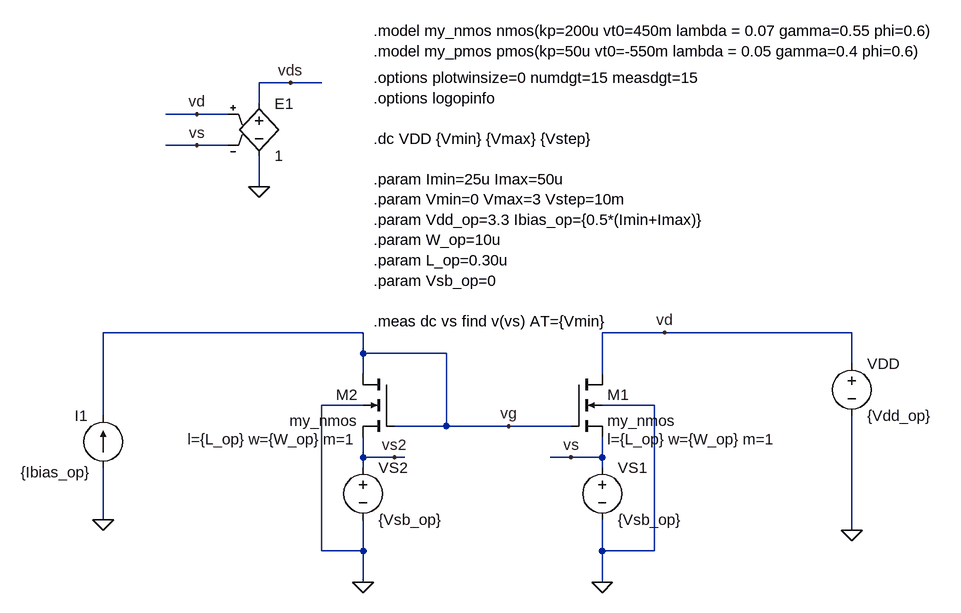
[diagram p0: schematic dc_no_step.asc]
dc_no_step.asc, the LTspice schematic file:
Version 4.1
SHEET 1 2428 7372
WIRE -736 -464 -784 -464
WIRE -688 -464 -736 -464
WIRE -784 -432 -784 -464
WIRE -880 -416 -928 -416
WIRE -832 -416 -880 -416
WIRE -880 -368 -928 -368
WIRE -832 -368 -880 -368
WIRE -784 -304 -784 -352
WIRE -624 -80 -1024 -80
WIRE -160 -80 -256 -80
WIRE 128 -80 -160 -80
WIRE -624 -48 -624 -80
WIRE -496 -48 -624 -48
WIRE 128 -32 128 -80
WIRE -624 -16 -624 -48
WIRE -256 -16 -256 -80
WIRE -624 32 -688 32
WIRE -176 32 -256 32
WIRE -1024 48 -1024 -80
WIRE -496 64 -496 -48
WIRE -496 64 -576 64
WIRE -400 64 -496 64
WIRE -304 64 -400 64
WIRE -624 112 -624 80
WIRE -576 112 -624 112
WIRE -560 112 -576 112
WIRE -304 112 -336 112
WIRE -256 112 -256 80
WIRE -256 112 -304 112
WIRE -624 128 -624 112
WIRE -256 128 -256 112
WIRE -1024 208 -1024 128
WIRE 128 224 128 48
WIRE -688 256 -688 32
WIRE -624 256 -624 208
WIRE -624 256 -688 256
WIRE -256 256 -256 208
WIRE -176 256 -176 32
WIRE -176 256 -256 256
WIRE -624 304 -624 256
WIRE -256 304 -256 256
FLAG -256 304 0
FLAG -624 304 0
FLAG 128 224 0
FLAG -1024 208 0
FLAG -400 64 vg
FLAG -160 -80 vd
FLAG -576 112 vs2
FLAG -304 112 vs
FLAG -784 -304 0
FLAG -736 -464 vds
FLAG -880 -416 vd
FLAG -880 -368 vs
SYMBOL voltage -256 112 R0
SYMATTR InstName VS1
SYMATTR Value {Vsb_op}
SYMBOL nmos4 -304 -16 R0
WINDOW 123 56 100 Left 2
SYMATTR Value2 l={L_op} w={W_op} m=1
SYMATTR InstName M1
SYMATTR Value my_nmos
SYMBOL nmos4 -576 -16 M0
WINDOW 123 56 100 Left 2
SYMATTR Value2 l={L_op} w={W_op} m=1
SYMATTR InstName M2
SYMATTR Value my_nmos
SYMBOL current -1024 128 R180
WINDOW 0 24 80 Left 2
WINDOW 3 19 -7 Left 2
SYMATTR InstName I1
SYMATTR Value {Ibias_op}
SYMBOL voltage -624 112 R0
SYMATTR InstName VS2
SYMATTR Value {Vsb_op}
SYMBOL voltage 128 -48 R0
SYMATTR InstName VDD
SYMATTR Value {Vdd_op}
SYMBOL e -784 -448 R0
SYMATTR InstName E1
SYMATTR Value 1
TEXT -608 -472 Left 2 !.options plotwinsize=0 numdgt=15 measdgt=15\n.options logopinfo\n \n.dc VDD {Vmin} {Vmax} {Vstep}\n \n.param Imin=25u Imax=50u\n.param Vmin=0 Vmax=3 Vstep=10m\n.param Vdd_op=3.3 Ibias_op={0.5*(Imin+Imax)}\n.param W_op=10u\n.param L_op=0.30u\n.param Vsb_op=0\n \n.meas dc vs find v(vs) AT={Vmin}
TEXT -608 -544 Left 2 !.model my_nmos nmos(kp=200u vt0=450m lambda = 0.07 gamma=0.55 phi=0.6)\n.model my_pmos pmos(kp=50u vt0=-550m lambda = 0.05 gamma=0.4 phi=0.6)

The netlist it stands for:
* dc_no_step.asc
VS1 vs 0 {Vsb_op}
M1 vd vg vs 0 my_nmos l={L_op} w={W_op} m=1
M2 vg vg vs2 0 my_nmos l={L_op} w={W_op} m=1
I1 0 vg {Ibias_op}
VS2 vs2 0 {Vsb_op}
VDD vd 0 {Vdd_op}
E1 vds 0 vd vs 1
.model NMOS NMOS
.model PMOS PMOS
.lib standard.mos
.options plotwinsize=0 numdgt=15 measdgt=15
.options logopinfo
.dc VDD {Vmin} {Vmax} {Vstep}
.param Imin=25u Imax=50u
.param Vmin=0 Vmax=3 Vstep=10m
.param Vdd_op=3.3 Ibias_op={0.5*(Imin+Imax)}
.param W_op=10u
.param L_op=0.30u
.param Vsb_op=0
.meas dc vs find v(vs) AT={Vmin}
.model my_nmos nmos(kp=200u vt0=450m lambda = 0.07 gamma=0.55 phi=0.6)
.model my_pmos pmos(kp=50u vt0=-550m lambda = 0.05 gamma=0.4 phi=0.6)
.backanno
.end